# Altium schematic sheet Microcontroller.SchDoc
size 381 x 241 mm; SheetNumber: 3; SheetTotal: 6